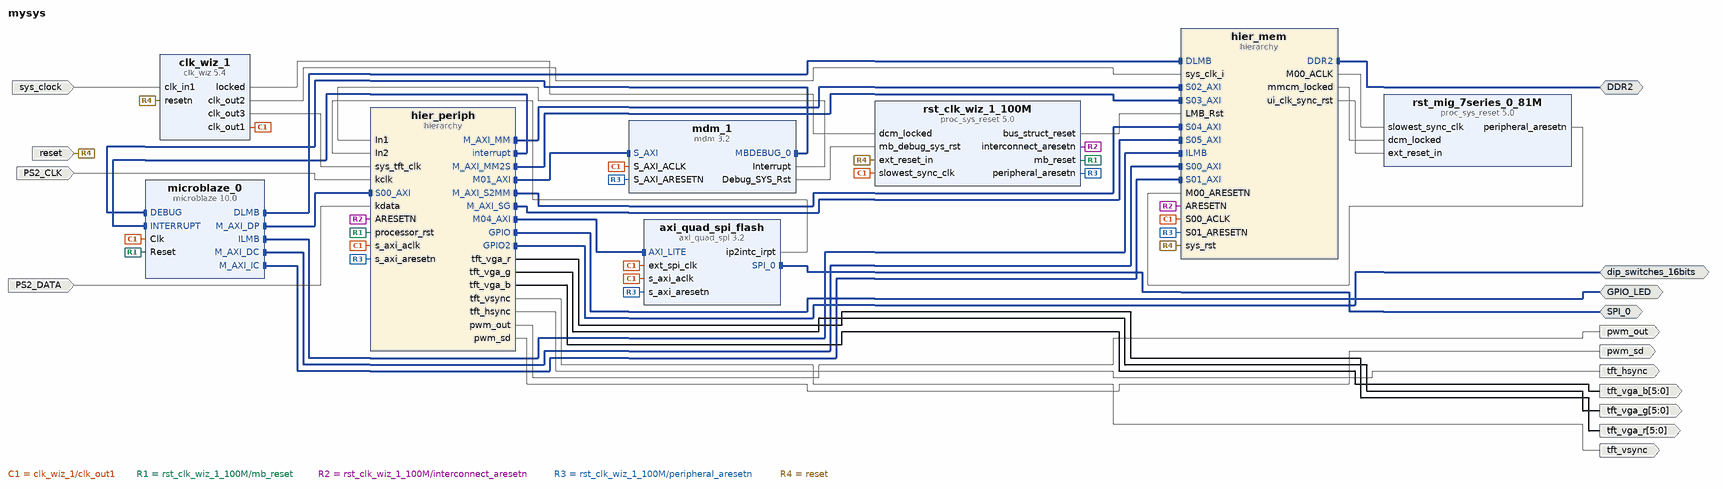
[diagram p0: block diagram of the top level]
# Vivado block design mysys, xc7a100tcsg324-1, Vivado 2017.1
create_bd_design mysys

create_bd_intf_port -mode Master -vlnv xilinx.com:interface:ddrx_rtl:1.0 DDR2
create_bd_intf_port -mode Master -vlnv xilinx.com:interface:gpio_rtl:1.0 GPIO_LED
create_bd_intf_port -mode Master -vlnv xilinx.com:interface:spi_rtl:1.0 SPI_0
create_bd_intf_port -mode Master -vlnv xilinx.com:interface:gpio_rtl:1.0 dip_switches_16bits
create_bd_port -dir I -type clk sys_clock
set_property -dict {CONFIG.FREQ_HZ 100000000 CONFIG.PHASE 0.000} [get_bd_ports sys_clock]
create_bd_port -dir I -type rst reset
set_property -dict {CONFIG.POLARITY ACTIVE_LOW} [get_bd_ports reset]
create_bd_port -dir O -from 5 -to 0 tft_vga_r
create_bd_port -dir O -from 5 -to 0 tft_vga_g
create_bd_port -dir O -from 5 -to 0 tft_vga_b
create_bd_port -dir O tft_vsync
create_bd_port -dir O tft_hsync
create_bd_port -dir O pwm_out
create_bd_port -dir O pwm_sd
create_bd_port -dir I PS2_CLK
create_bd_port -dir I PS2_DATA

create_bd_cell -type hier hier_mem
create_bd_cell -type ip -vlnv xilinx.com:ip:clk_wiz:5.4 clk_wiz_1
set_property -dict [list \
  CONFIG.CLKOUT2_USED true \
  CONFIG.CLKOUT3_USED true \
  CONFIG.CLKOUT4_USED false \
  CONFIG.NUM_OUT_CLKS 3 \
  CONFIG.CLKOUT2_REQUESTED_OUT_FREQ 200.000 \
  CONFIG.CLKOUT3_REQUESTED_OUT_FREQ 25.000 \
  CONFIG.RESET_PORT resetn \
  CONFIG.MMCM_CLKIN1_PERIOD 10.000 \
  CONFIG.MMCM_CLKIN2_PERIOD 10.000 \
  CONFIG.MMCM_CLKOUT1_DIVIDE 5 \
  CONFIG.MMCM_CLKOUT2_DIVIDE 40 \
  CONFIG.RESET_TYPE ACTIVE_LOW \
  CONFIG.USE_BOARD_FLOW true \
  CONFIG.CLK_IN1_BOARD_INTERFACE sys_clock \
  CONFIG.RESET_BOARD_INTERFACE reset \
  CONFIG.CLKOUT2_JITTER 114.829 \
  CONFIG.CLKOUT2_PHASE_ERROR 98.575 \
  CONFIG.CLKOUT3_JITTER 175.402 \
  CONFIG.CLKOUT3_PHASE_ERROR 98.575 \
  CONFIG.CLKOUT4_JITTER 130.958 \
  CONFIG.CLKOUT4_PHASE_ERROR 98.575 \
] [get_bd_cells clk_wiz_1]
create_bd_cell -type ip -vlnv xilinx.com:ip:microblaze:10.0 microblaze_0
set_property -dict [list \
  CONFIG.C_FREQ 100000000 \
  CONFIG.C_AREA_OPTIMIZED 2 \
  CONFIG.C_D_AXI 1 \
  CONFIG.C_D_LMB 1 \
  CONFIG.C_I_AXI 0 \
  CONFIG.C_I_LMB 1 \
  CONFIG.C_M_AXI_DC_USER_SIGNALS 0 \
  CONFIG.C_M_AXI_IC_USER_SIGNALS 0 \
  CONFIG.G_TEMPLATE_LIST 2 \
  CONFIG.G_USE_EXCEPTIONS 0 \
  CONFIG.C_USE_MSR_INSTR 1 \
  CONFIG.C_USE_PCMP_INSTR 1 \
  CONFIG.C_USE_BARREL 1 \
  CONFIG.C_USE_DIV 1 \
  CONFIG.C_USE_HW_MUL 2 \
  CONFIG.C_USE_FPU 2 \
  CONFIG.C_UNALIGNED_EXCEPTIONS 0 \
  CONFIG.C_ILL_OPCODE_EXCEPTION 0 \
  CONFIG.C_M_AXI_I_BUS_EXCEPTION 0 \
  CONFIG.C_M_AXI_D_BUS_EXCEPTION 0 \
  CONFIG.C_DIV_ZERO_EXCEPTION 0 \
  CONFIG.C_FPU_EXCEPTION 0 \
  CONFIG.C_PVR 0 \
  CONFIG.C_DEBUG_ENABLED 1 \
  CONFIG.C_NUMBER_OF_PC_BRK 1 \
  CONFIG.C_FSL_LINKS 0 \
  CONFIG.C_ICACHE_BASEADDR 0x0000000080000000 \
  CONFIG.C_ICACHE_HIGHADDR 0x0000000087FFFFFF \
  CONFIG.C_USE_ICACHE 1 \
  CONFIG.C_CACHE_BYTE_SIZE 32768 \
  CONFIG.C_ICACHE_LINE_LEN 16 \
  CONFIG.C_ICACHE_ALWAYS_USED 1 \
  CONFIG.C_ICACHE_VICTIMS 8 \
  CONFIG.C_ICACHE_STREAMS 1 \
  CONFIG.C_ICACHE_DATA_WIDTH 0 \
  CONFIG.C_DCACHE_BASEADDR 0x0000000080000000 \
  CONFIG.C_DCACHE_HIGHADDR 0x0000000087FFFFFF \
  CONFIG.C_USE_DCACHE 1 \
  CONFIG.C_DCACHE_BYTE_SIZE 32768 \
  CONFIG.C_DCACHE_LINE_LEN 16 \
  CONFIG.C_DCACHE_ALWAYS_USED 1 \
  CONFIG.C_DCACHE_USE_WRITEBACK 1 \
  CONFIG.C_DCACHE_VICTIMS 8 \
  CONFIG.C_DCACHE_DATA_WIDTH 0 \
  CONFIG.C_USE_MMU 0 \
  CONFIG.C_USE_INTERRUPT 1 \
  CONFIG.C_USE_EXT_BRK 0 \
  CONFIG.C_USE_EXT_NM_BRK 0 \
  CONFIG.C_USE_BRANCH_TARGET_CACHE 1 \
] [get_bd_cells microblaze_0]
create_bd_cell -type ip -vlnv xilinx.com:ip:proc_sys_reset:5.0 rst_clk_wiz_1_100M
set_property -dict [list \
  CONFIG.C_AUX_RESET_HIGH 0 \
  CONFIG.C_EXT_RESET_HIGH 0 \
  CONFIG.USE_BOARD_FLOW true \
  CONFIG.RESET_BOARD_INTERFACE reset \
] [get_bd_cells rst_clk_wiz_1_100M]
create_bd_cell -type ip -vlnv xilinx.com:ip:proc_sys_reset:5.0 rst_mig_7series_0_81M
set_property -dict {CONFIG.C_AUX_RESET_HIGH 0} [get_bd_cells rst_mig_7series_0_81M]
create_bd_cell -type ip -vlnv xilinx.com:ip:axi_quad_spi:3.2 axi_quad_spi_flash
set_property -dict {CONFIG.C_SCK_RATIO 2 CONFIG.C_S_AXI4_ID_WIDTH 0} [get_bd_cells axi_quad_spi_flash]
create_bd_cell -type ip -vlnv xilinx.com:ip:mdm:3.2 mdm_1
set_property -dict {CONFIG.C_USE_UART 1} [get_bd_cells mdm_1]
create_bd_cell -type hier hier_periph

# ---- hierarchy /hier_mem ----
current_bd_instance /hier_mem
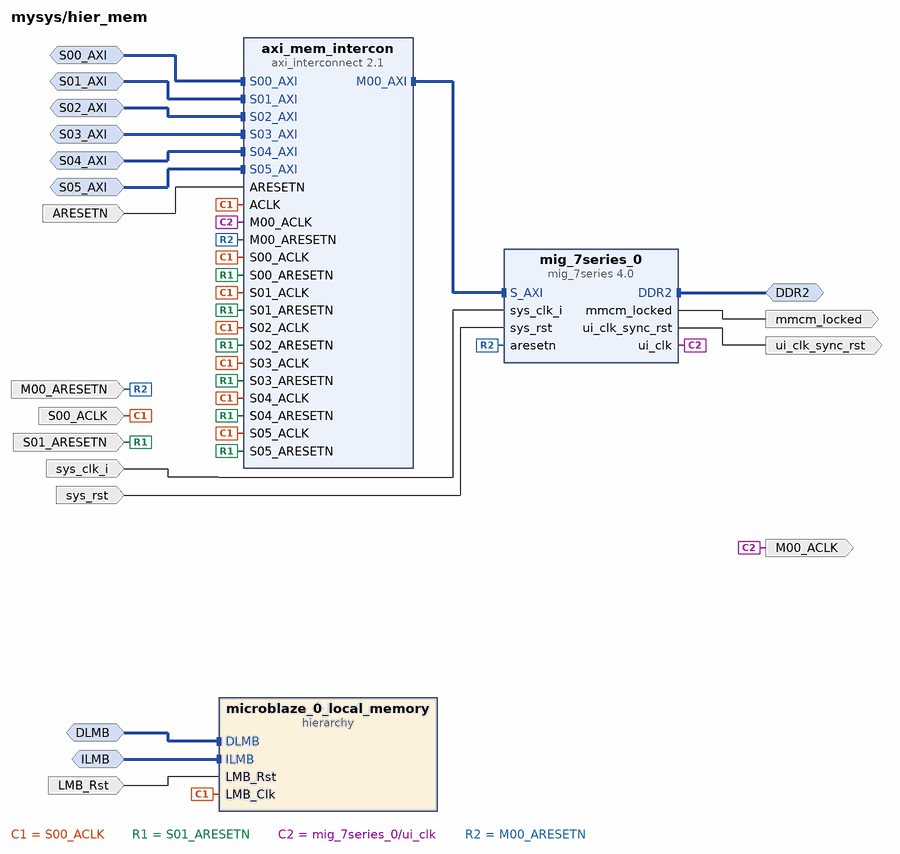
[diagram p1: block diagram inside /hier_mem]
create_bd_intf_pin -mode Master -vlnv xilinx.com:interface:ddrx_rtl:1.0 DDR2
create_bd_intf_pin -mode MirroredMaster -vlnv xilinx.com:interface:lmb_rtl:1.0 DLMB
create_bd_intf_pin -mode MirroredMaster -vlnv xilinx.com:interface:lmb_rtl:1.0 ILMB
create_bd_intf_pin -mode Slave -vlnv xilinx.com:interface:aximm_rtl:1.0 S00_AXI
create_bd_intf_pin -mode Slave -vlnv xilinx.com:interface:aximm_rtl:1.0 S01_AXI
create_bd_intf_pin -mode Slave -vlnv xilinx.com:interface:aximm_rtl:1.0 S02_AXI
create_bd_intf_pin -mode Slave -vlnv xilinx.com:interface:aximm_rtl:1.0 S03_AXI
create_bd_intf_pin -mode Slave -vlnv xilinx.com:interface:aximm_rtl:1.0 S04_AXI
create_bd_intf_pin -mode Slave -vlnv xilinx.com:interface:aximm_rtl:1.0 S05_AXI
create_bd_pin -dir I -type clk S00_ACLK
create_bd_pin -dir I -type rst LMB_Rst
create_bd_pin -dir I -type rst S01_ARESETN
create_bd_pin -dir I -type rst ARESETN
create_bd_pin -dir I -type clk sys_clk_i
create_bd_pin -dir I -type rst sys_rst
create_bd_pin -dir O -type clk M00_ACLK
create_bd_pin -dir O -type rst ui_clk_sync_rst
create_bd_pin -dir I -type rst M00_ARESETN
create_bd_pin -dir O mmcm_locked

create_bd_cell -type hier microblaze_0_local_memory
create_bd_cell -type ip -vlnv xilinx.com:ip:axi_interconnect:2.1 axi_mem_intercon
set_property -dict {CONFIG.NUM_SI 6 CONFIG.NUM_MI 1} [get_bd_cells axi_mem_intercon]
create_bd_cell -type ip -vlnv xilinx.com:ip:mig_7series:4.0 mig_7series_0
set_property -dict [list \
  CONFIG.XML_INPUT_FILE mig_b.prj \
  CONFIG.RESET_BOARD_INTERFACE reset \
  CONFIG.MIG_DONT_TOUCH_PARAM Custom \
  CONFIG.BOARD_MIG_PARAM Custom \
] [get_bd_cells mig_7series_0]

# ---- hierarchy /hier_mem/microblaze_0_local_memory ----
current_bd_instance /hier_mem/microblaze_0_local_memory
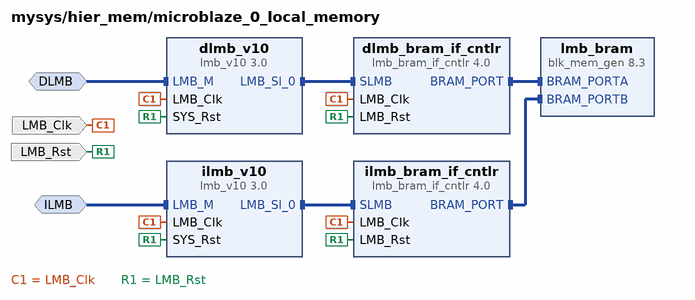
[diagram p2: block diagram inside /hier_mem/microblaze_0_local_memory]
create_bd_intf_pin -mode MirroredMaster -vlnv xilinx.com:interface:lmb_rtl:1.0 DLMB
create_bd_intf_pin -mode MirroredMaster -vlnv xilinx.com:interface:lmb_rtl:1.0 ILMB
create_bd_pin -dir I -type clk LMB_Clk
create_bd_pin -dir I -type rst LMB_Rst

create_bd_cell -type ip -vlnv xilinx.com:ip:lmb_bram_if_cntlr:4.0 dlmb_bram_if_cntlr
set_property -dict [list \
  CONFIG.C_BASEADDR 0x0000000000000000 \
  CONFIG.C_HIGHADDR 0x0000000000003FFF \
  CONFIG.C_MASK 0x00000000C0000000 \
  CONFIG.C_ECC 0 \
] [get_bd_cells dlmb_bram_if_cntlr]
create_bd_cell -type ip -vlnv xilinx.com:ip:lmb_v10:3.0 dlmb_v10
create_bd_cell -type ip -vlnv xilinx.com:ip:lmb_bram_if_cntlr:4.0 ilmb_bram_if_cntlr
set_property -dict [list \
  CONFIG.C_BASEADDR 0x0000000000000000 \
  CONFIG.C_HIGHADDR 0x0000000000003FFF \
  CONFIG.C_MASK 0x0000000080000000 \
  CONFIG.C_ECC 0 \
] [get_bd_cells ilmb_bram_if_cntlr]
create_bd_cell -type ip -vlnv xilinx.com:ip:lmb_v10:3.0 ilmb_v10
create_bd_cell -type ip -vlnv xilinx.com:ip:blk_mem_gen:8.3 lmb_bram
set_property -dict [list \
  CONFIG.Memory_Type True_Dual_Port_RAM \
  CONFIG.Enable_B Use_ENB_Pin \
  CONFIG.Use_RSTB_Pin true \
  CONFIG.Port_B_Clock 100 \
  CONFIG.Port_B_Write_Rate 50 \
  CONFIG.Port_B_Enable_Rate 100 \
  CONFIG.use_bram_block BRAM_Controller \
] [get_bd_cells lmb_bram]

# ---- hierarchy /hier_periph ----
current_bd_instance /hier_periph
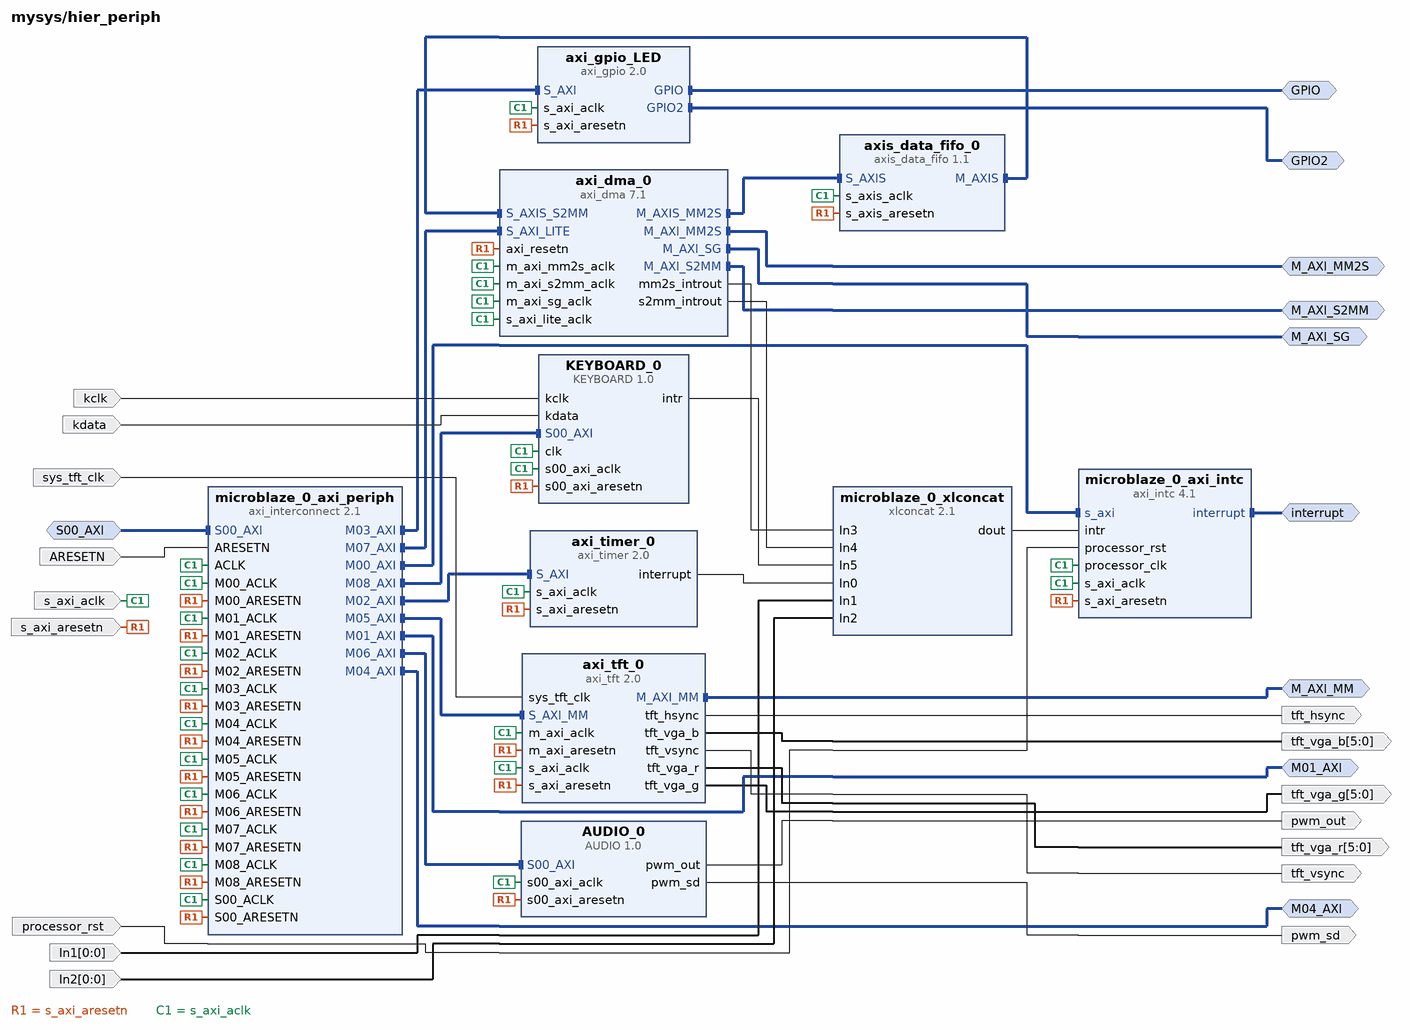
[diagram p3: block diagram inside /hier_periph]
create_bd_intf_pin -mode Master -vlnv xilinx.com:interface:gpio_rtl:1.0 GPIO
create_bd_intf_pin -mode Master -vlnv xilinx.com:interface:aximm_rtl:1.0 M_AXI_MM
create_bd_intf_pin -mode Master -vlnv xilinx.com:interface:mbinterrupt_rtl:1.0 interrupt
create_bd_intf_pin -mode Master -vlnv xilinx.com:interface:aximm_rtl:1.0 M_AXI_SG
create_bd_intf_pin -mode Master -vlnv xilinx.com:interface:aximm_rtl:1.0 M_AXI_MM2S
create_bd_intf_pin -mode Master -vlnv xilinx.com:interface:aximm_rtl:1.0 M_AXI_S2MM
create_bd_intf_pin -mode Slave -vlnv xilinx.com:interface:aximm_rtl:1.0 S00_AXI
create_bd_intf_pin -mode Master -vlnv xilinx.com:interface:aximm_rtl:1.0 M01_AXI
create_bd_intf_pin -mode Master -vlnv xilinx.com:interface:aximm_rtl:1.0 M04_AXI
create_bd_intf_pin -mode Master -vlnv xilinx.com:interface:gpio_rtl:1.0 GPIO2
create_bd_pin -dir I -type rst s_axi_aresetn
create_bd_pin -dir I -type clk s_axi_aclk
create_bd_pin -dir I -type clk sys_tft_clk
create_bd_pin -dir O tft_hsync
create_bd_pin -dir O tft_vsync
create_bd_pin -dir O -from 5 -to 0 tft_vga_r
create_bd_pin -dir O -from 5 -to 0 tft_vga_g
create_bd_pin -dir O -from 5 -to 0 tft_vga_b
create_bd_pin -dir I kclk
create_bd_pin -dir I kdata
create_bd_pin -dir O pwm_out
create_bd_pin -dir O pwm_sd
create_bd_pin -dir I -type rst processor_rst
create_bd_pin -dir I -from 0 -to 0 In1
create_bd_pin -dir I -from 0 -to 0 In2
create_bd_pin -dir I -type rst ARESETN

create_bd_cell -type ip -vlnv xilinx.com:ip:axis_data_fifo:1.1 axis_data_fifo_0
set_property -dict {CONFIG.FIFO_DEPTH 128} [get_bd_cells axis_data_fifo_0]
create_bd_cell -type ip -vlnv xilinx.com:ip:axi_gpio:2.0 axi_gpio_LED
set_property -dict [list \
  CONFIG.USE_BOARD_FLOW true \
  CONFIG.GPIO_BOARD_INTERFACE led_16bits \
  CONFIG.GPIO2_BOARD_INTERFACE dip_switches_16bits \
] [get_bd_cells axi_gpio_LED]
create_bd_cell -type ip -vlnv xilinx.com:ip:axi_tft:2.0 axi_tft_0
set_property -dict [list \
  CONFIG.C_MAX_BURST_LEN 256 \
  CONFIG.C_M_AXI_DATA_WIDTH 32 \
  CONFIG.C_DEFAULT_TFT_BASE_ADDR 0x00000000F0000000 \
  CONFIG.C_EN_I2C_INTF 0 \
  CONFIG.C_TFT_INTERFACE 0 \
] [get_bd_cells axi_tft_0]
create_bd_cell -type ip -vlnv xilinx.com:user:AUDIO:1.0 AUDIO_0
create_bd_cell -type ip -vlnv xilinx.com:ip:axi_intc:4.1 microblaze_0_axi_intc
set_property -dict {CONFIG.C_HAS_FAST 1} [get_bd_cells microblaze_0_axi_intc]
create_bd_cell -type ip -vlnv xilinx.com:ip:xlconcat:2.1 microblaze_0_xlconcat
set_property -dict {CONFIG.NUM_PORTS 6 CONFIG.dout_width 6} [get_bd_cells microblaze_0_xlconcat]
create_bd_cell -type ip -vlnv xilinx.com:ip:axi_timer:2.0 axi_timer_0
create_bd_cell -type ip -vlnv xilinx.com:ip:axi_dma:7.1 axi_dma_0
set_property -dict [list \
  CONFIG.c_include_sg 1 \
  CONFIG.c_enable_multi_channel 0 \
  CONFIG.c_sg_include_stscntrl_strm 0 \
  CONFIG.c_micro_dma 0 \
  CONFIG.c_include_mm2s_dre 0 \
  CONFIG.c_mm2s_burst_size 16 \
  CONFIG.c_include_s2mm_dre 0 \
  CONFIG.c_s2mm_burst_size 64 \
] [get_bd_cells axi_dma_0]
create_bd_cell -type ip -vlnv xilinx.com:ip:axi_interconnect:2.1 microblaze_0_axi_periph
set_property -dict {CONFIG.NUM_MI 9} [get_bd_cells microblaze_0_axi_periph]
create_bd_cell -type ip -vlnv xilinx.com:user:KEYBOARD:1.0 KEYBOARD_0

# ---- connections ----

current_bd_instance /hier_mem
connect_bd_intf_net [get_bd_intf_pins axi_mem_intercon/M00_AXI] [get_bd_intf_pins mig_7series_0/S_AXI]
connect_bd_intf_net [get_bd_intf_pins DDR2] [get_bd_intf_pins mig_7series_0/DDR2]
connect_bd_intf_net -intf_net microblaze_0_dlmb_1 [get_bd_intf_pins DLMB] [get_bd_intf_pins microblaze_0_local_memory/DLMB]
connect_bd_intf_net -intf_net microblaze_0_ilmb_1 [get_bd_intf_pins ILMB] [get_bd_intf_pins microblaze_0_local_memory/ILMB]
connect_bd_intf_net -intf_net microblaze_0_M_AXI_DC [get_bd_intf_pins S00_AXI] [get_bd_intf_pins axi_mem_intercon/S00_AXI]
connect_bd_intf_net -intf_net microblaze_0_M_AXI_IC [get_bd_intf_pins S01_AXI] [get_bd_intf_pins axi_mem_intercon/S01_AXI]
connect_bd_intf_net [get_bd_intf_pins S02_AXI] [get_bd_intf_pins axi_mem_intercon/S02_AXI]
connect_bd_intf_net [get_bd_intf_pins S03_AXI] [get_bd_intf_pins axi_mem_intercon/S03_AXI]
connect_bd_intf_net [get_bd_intf_pins S04_AXI] [get_bd_intf_pins axi_mem_intercon/S04_AXI]
connect_bd_intf_net [get_bd_intf_pins S05_AXI] [get_bd_intf_pins axi_mem_intercon/S05_AXI]
connect_bd_net -net microblaze_0_Clk [get_bd_pins S00_ACLK] \
  [get_bd_pins microblaze_0_local_memory/LMB_Clk] [get_bd_pins axi_mem_intercon/ACLK] [get_bd_pins axi_mem_intercon/S00_ACLK] \
  [get_bd_pins axi_mem_intercon/S01_ACLK] [get_bd_pins axi_mem_intercon/S02_ACLK] [get_bd_pins axi_mem_intercon/S03_ACLK] \
  [get_bd_pins axi_mem_intercon/S04_ACLK] [get_bd_pins axi_mem_intercon/S05_ACLK]
connect_bd_net -net rst_clk_wiz_1_100M_bus_struct_reset [get_bd_pins LMB_Rst] [get_bd_pins microblaze_0_local_memory/LMB_Rst]
connect_bd_net -net rst_clk_wiz_1_100M_peripheral_aresetn [get_bd_pins S01_ARESETN] \
  [get_bd_pins axi_mem_intercon/S00_ARESETN] [get_bd_pins axi_mem_intercon/S01_ARESETN] \
  [get_bd_pins axi_mem_intercon/S02_ARESETN] [get_bd_pins axi_mem_intercon/S03_ARESETN] \
  [get_bd_pins axi_mem_intercon/S04_ARESETN] [get_bd_pins axi_mem_intercon/S05_ARESETN]
connect_bd_net -net rst_clk_wiz_1_100M_interconnect_aresetn [get_bd_pins ARESETN] [get_bd_pins axi_mem_intercon/ARESETN]
connect_bd_net -net clk_wiz_1_clk_out2 [get_bd_pins sys_clk_i] [get_bd_pins mig_7series_0/sys_clk_i]
connect_bd_net -net reset_1 [get_bd_pins sys_rst] [get_bd_pins mig_7series_0/sys_rst]
connect_bd_net [get_bd_pins mig_7series_0/ui_clk] [get_bd_pins M00_ACLK] [get_bd_pins axi_mem_intercon/M00_ACLK]
connect_bd_net [get_bd_pins mig_7series_0/ui_clk_sync_rst] [get_bd_pins ui_clk_sync_rst]
connect_bd_net -net rst_mig_7series_0_81M_peripheral_aresetn [get_bd_pins M00_ARESETN] \
  [get_bd_pins mig_7series_0/aresetn] [get_bd_pins axi_mem_intercon/M00_ARESETN]
connect_bd_net [get_bd_pins mig_7series_0/mmcm_locked] [get_bd_pins mmcm_locked]

current_bd_instance /hier_mem/microblaze_0_local_memory
connect_bd_intf_net -intf_net microblaze_0_dlmb_bus [get_bd_intf_pins dlmb_v10/LMB_Sl_0] [get_bd_intf_pins dlmb_bram_if_cntlr/SLMB]
connect_bd_intf_net -intf_net microblaze_0_ilmb_bus [get_bd_intf_pins ilmb_v10/LMB_Sl_0] [get_bd_intf_pins ilmb_bram_if_cntlr/SLMB]
connect_bd_intf_net -intf_net microblaze_0_dlmb_cntlr [get_bd_intf_pins dlmb_bram_if_cntlr/BRAM_PORT] [get_bd_intf_pins lmb_bram/BRAM_PORTA]
connect_bd_intf_net -intf_net microblaze_0_ilmb_cntlr [get_bd_intf_pins ilmb_bram_if_cntlr/BRAM_PORT] [get_bd_intf_pins lmb_bram/BRAM_PORTB]
connect_bd_intf_net -intf_net microblaze_0_dlmb [get_bd_intf_pins DLMB] [get_bd_intf_pins dlmb_v10/LMB_M]
connect_bd_intf_net -intf_net microblaze_0_ilmb [get_bd_intf_pins ILMB] [get_bd_intf_pins ilmb_v10/LMB_M]
connect_bd_net -net microblaze_0_Clk [get_bd_pins LMB_Clk] \
  [get_bd_pins dlmb_bram_if_cntlr/LMB_Clk] [get_bd_pins dlmb_v10/LMB_Clk] [get_bd_pins ilmb_bram_if_cntlr/LMB_Clk] \
  [get_bd_pins ilmb_v10/LMB_Clk]
connect_bd_net -net microblaze_0_LMB_Rst [get_bd_pins LMB_Rst] \
  [get_bd_pins dlmb_bram_if_cntlr/LMB_Rst] [get_bd_pins dlmb_v10/SYS_Rst] [get_bd_pins ilmb_bram_if_cntlr/LMB_Rst] \
  [get_bd_pins ilmb_v10/SYS_Rst]

current_bd_instance /hier_periph
connect_bd_intf_net [get_bd_intf_pins axi_dma_0/M_AXIS_MM2S] [get_bd_intf_pins axis_data_fifo_0/S_AXIS]
connect_bd_intf_net [get_bd_intf_pins axi_dma_0/S_AXIS_S2MM] [get_bd_intf_pins axis_data_fifo_0/M_AXIS]
connect_bd_intf_net [get_bd_intf_pins microblaze_0_axi_periph/M03_AXI] [get_bd_intf_pins axi_gpio_LED/S_AXI]
connect_bd_intf_net [get_bd_intf_pins axi_tft_0/S_AXI_MM] [get_bd_intf_pins microblaze_0_axi_periph/M05_AXI]
connect_bd_intf_net [get_bd_intf_pins microblaze_0_axi_periph/M08_AXI] [get_bd_intf_pins KEYBOARD_0/S00_AXI]
connect_bd_intf_net [get_bd_intf_pins AUDIO_0/S00_AXI] [get_bd_intf_pins microblaze_0_axi_periph/M06_AXI]
connect_bd_intf_net [get_bd_intf_pins microblaze_0_axi_periph/M00_AXI] [get_bd_intf_pins microblaze_0_axi_intc/s_axi]
connect_bd_intf_net [get_bd_intf_pins microblaze_0_axi_periph/M02_AXI] [get_bd_intf_pins axi_timer_0/S_AXI]
connect_bd_intf_net [get_bd_intf_pins axi_dma_0/S_AXI_LITE] [get_bd_intf_pins microblaze_0_axi_periph/M07_AXI]
connect_bd_intf_net [get_bd_intf_pins GPIO] [get_bd_intf_pins axi_gpio_LED/GPIO]
connect_bd_intf_net [get_bd_intf_pins M_AXI_MM] [get_bd_intf_pins axi_tft_0/M_AXI_MM]
connect_bd_intf_net -intf_net axi_intc_0_interrupt [get_bd_intf_pins interrupt] [get_bd_intf_pins microblaze_0_axi_intc/interrupt]
connect_bd_intf_net [get_bd_intf_pins M_AXI_SG] [get_bd_intf_pins axi_dma_0/M_AXI_SG]
connect_bd_intf_net [get_bd_intf_pins M_AXI_MM2S] [get_bd_intf_pins axi_dma_0/M_AXI_MM2S]
connect_bd_intf_net [get_bd_intf_pins M_AXI_S2MM] [get_bd_intf_pins axi_dma_0/M_AXI_S2MM]
connect_bd_intf_net -intf_net microblaze_0_axi_dp [get_bd_intf_pins S00_AXI] [get_bd_intf_pins microblaze_0_axi_periph/S00_AXI]
connect_bd_intf_net -intf_net microblaze_0_mdm_axi [get_bd_intf_pins M01_AXI] [get_bd_intf_pins microblaze_0_axi_periph/M01_AXI]
connect_bd_intf_net [get_bd_intf_pins M04_AXI] [get_bd_intf_pins microblaze_0_axi_periph/M04_AXI]
connect_bd_intf_net [get_bd_intf_pins GPIO2] [get_bd_intf_pins axi_gpio_LED/GPIO2]
connect_bd_net [get_bd_pins KEYBOARD_0/intr] [get_bd_pins microblaze_0_xlconcat/In5]
connect_bd_net [get_bd_pins microblaze_0_xlconcat/dout] [get_bd_pins microblaze_0_axi_intc/intr]
connect_bd_net [get_bd_pins axi_timer_0/interrupt] [get_bd_pins microblaze_0_xlconcat/In0]
connect_bd_net [get_bd_pins axi_dma_0/mm2s_introut] [get_bd_pins microblaze_0_xlconcat/In3]
connect_bd_net [get_bd_pins axi_dma_0/s2mm_introut] [get_bd_pins microblaze_0_xlconcat/In4]
connect_bd_net -net rst_clk_wiz_1_100M_peripheral_aresetn [get_bd_pins s_axi_aresetn] \
  [get_bd_pins axi_tft_0/s_axi_aresetn] [get_bd_pins axi_tft_0/m_axi_aresetn] [get_bd_pins AUDIO_0/s00_axi_aresetn] \
  [get_bd_pins axi_dma_0/axi_resetn] [get_bd_pins axi_gpio_LED/s_axi_aresetn] [get_bd_pins axi_timer_0/s_axi_aresetn] \
  [get_bd_pins microblaze_0_axi_intc/s_axi_aresetn] [get_bd_pins axis_data_fifo_0/s_axis_aresetn] \
  [get_bd_pins KEYBOARD_0/s00_axi_aresetn] [get_bd_pins microblaze_0_axi_periph/S00_ARESETN] \
  [get_bd_pins microblaze_0_axi_periph/M00_ARESETN] [get_bd_pins microblaze_0_axi_periph/M01_ARESETN] \
  [get_bd_pins microblaze_0_axi_periph/M02_ARESETN] [get_bd_pins microblaze_0_axi_periph/M03_ARESETN] \
  [get_bd_pins microblaze_0_axi_periph/M04_ARESETN] [get_bd_pins microblaze_0_axi_periph/M05_ARESETN] \
  [get_bd_pins microblaze_0_axi_periph/M06_ARESETN] [get_bd_pins microblaze_0_axi_periph/M07_ARESETN] \
  [get_bd_pins microblaze_0_axi_periph/M08_ARESETN]
connect_bd_net -net microblaze_0_Clk [get_bd_pins s_axi_aclk] \
  [get_bd_pins axi_tft_0/s_axi_aclk] [get_bd_pins axi_tft_0/m_axi_aclk] [get_bd_pins AUDIO_0/s00_axi_aclk] \
  [get_bd_pins axi_dma_0/s_axi_lite_aclk] [get_bd_pins axi_dma_0/m_axi_mm2s_aclk] [get_bd_pins axi_dma_0/m_axi_s2mm_aclk] \
  [get_bd_pins axi_dma_0/m_axi_sg_aclk] [get_bd_pins axi_gpio_LED/s_axi_aclk] [get_bd_pins axi_timer_0/s_axi_aclk] \
  [get_bd_pins microblaze_0_axi_intc/s_axi_aclk] [get_bd_pins microblaze_0_axi_intc/processor_clk] \
  [get_bd_pins axis_data_fifo_0/s_axis_aclk] [get_bd_pins KEYBOARD_0/clk] [get_bd_pins KEYBOARD_0/s00_axi_aclk] \
  [get_bd_pins microblaze_0_axi_periph/ACLK] [get_bd_pins microblaze_0_axi_periph/S00_ACLK] \
  [get_bd_pins microblaze_0_axi_periph/M00_ACLK] [get_bd_pins microblaze_0_axi_periph/M01_ACLK] \
  [get_bd_pins microblaze_0_axi_periph/M02_ACLK] [get_bd_pins microblaze_0_axi_periph/M03_ACLK] \
  [get_bd_pins microblaze_0_axi_periph/M04_ACLK] [get_bd_pins microblaze_0_axi_periph/M05_ACLK] \
  [get_bd_pins microblaze_0_axi_periph/M06_ACLK] [get_bd_pins microblaze_0_axi_periph/M07_ACLK] \
  [get_bd_pins microblaze_0_axi_periph/M08_ACLK]
connect_bd_net -net clk_wiz_1_clk_out3 [get_bd_pins sys_tft_clk] [get_bd_pins axi_tft_0/sys_tft_clk]
connect_bd_net [get_bd_pins axi_tft_0/tft_hsync] [get_bd_pins tft_hsync]
connect_bd_net [get_bd_pins axi_tft_0/tft_vsync] [get_bd_pins tft_vsync]
connect_bd_net [get_bd_pins axi_tft_0/tft_vga_r] [get_bd_pins tft_vga_r]
connect_bd_net [get_bd_pins axi_tft_0/tft_vga_g] [get_bd_pins tft_vga_g]
connect_bd_net [get_bd_pins axi_tft_0/tft_vga_b] [get_bd_pins tft_vga_b]
connect_bd_net [get_bd_pins kclk] [get_bd_pins KEYBOARD_0/kclk]
connect_bd_net [get_bd_pins kdata] [get_bd_pins KEYBOARD_0/kdata]
connect_bd_net [get_bd_pins AUDIO_0/pwm_out] [get_bd_pins pwm_out]
connect_bd_net [get_bd_pins AUDIO_0/pwm_sd] [get_bd_pins pwm_sd]
connect_bd_net -net rst_clk_wiz_1_100M_mb_reset [get_bd_pins processor_rst] [get_bd_pins microblaze_0_axi_intc/processor_rst]
connect_bd_net -net mdm_1_Interrupt [get_bd_pins In1] [get_bd_pins microblaze_0_xlconcat/In1]
connect_bd_net -net axi_quad_spi_flash_ip2intc_irpt [get_bd_pins In2] [get_bd_pins microblaze_0_xlconcat/In2]
connect_bd_net -net rst_clk_wiz_1_100M_interconnect_aresetn [get_bd_pins ARESETN] [get_bd_pins microblaze_0_axi_periph/ARESETN]

current_bd_instance /
connect_bd_intf_net [get_bd_intf_pins microblaze_0/DLMB] [get_bd_intf_pins hier_mem/DLMB]
connect_bd_intf_net [get_bd_intf_pins microblaze_0/ILMB] [get_bd_intf_pins hier_mem/ILMB]
connect_bd_intf_net -intf_net microblaze_0_axi_dp [get_bd_intf_pins hier_periph/S00_AXI] [get_bd_intf_pins microblaze_0/M_AXI_DP]
connect_bd_intf_net [get_bd_intf_pins mdm_1/MBDEBUG_0] [get_bd_intf_pins microblaze_0/DEBUG]
connect_bd_intf_net [get_bd_intf_pins microblaze_0/M_AXI_DC] [get_bd_intf_pins hier_mem/S00_AXI]
connect_bd_intf_net [get_bd_intf_pins microblaze_0/M_AXI_IC] [get_bd_intf_pins hier_mem/S01_AXI]
connect_bd_intf_net -intf_net axi_tft_0_M_AXI_MM [get_bd_intf_pins hier_periph/M_AXI_MM] [get_bd_intf_pins hier_mem/S02_AXI]
connect_bd_intf_net -intf_net axi_dma_0_M_AXI_MM2S [get_bd_intf_pins hier_periph/M_AXI_MM2S] [get_bd_intf_pins hier_mem/S03_AXI]
connect_bd_intf_net -intf_net axi_dma_0_M_AXI_S2MM [get_bd_intf_pins hier_periph/M_AXI_S2MM] [get_bd_intf_pins hier_mem/S04_AXI]
connect_bd_intf_net -intf_net axi_dma_0_M_AXI_SG [get_bd_intf_pins hier_periph/M_AXI_SG] [get_bd_intf_pins hier_mem/S05_AXI]
connect_bd_intf_net [get_bd_intf_pins hier_periph/M04_AXI] [get_bd_intf_pins axi_quad_spi_flash/AXI_LITE]
connect_bd_intf_net -intf_net microblaze_0_mdm_axi [get_bd_intf_pins hier_periph/M01_AXI] [get_bd_intf_pins mdm_1/S_AXI]
connect_bd_intf_net -intf_net axi_intc_0_interrupt [get_bd_intf_pins microblaze_0/INTERRUPT] [get_bd_intf_pins hier_periph/interrupt]
connect_bd_intf_net -intf_net mig_7series_0_DDR2 [get_bd_intf_ports DDR2] [get_bd_intf_pins hier_mem/DDR2]
connect_bd_intf_net -intf_net axi_gpio_LED_GPIO [get_bd_intf_ports GPIO_LED] [get_bd_intf_pins hier_periph/GPIO]
connect_bd_intf_net -intf_net axi_quad_spi_0_SPI_0 [get_bd_intf_ports SPI_0] [get_bd_intf_pins axi_quad_spi_flash/SPI_0]
connect_bd_intf_net [get_bd_intf_ports dip_switches_16bits] [get_bd_intf_pins hier_periph/GPIO2]
connect_bd_net -net microblaze_0_Clk [get_bd_pins clk_wiz_1/clk_out1] \
  [get_bd_pins microblaze_0/Clk] [get_bd_pins rst_clk_wiz_1_100M/slowest_sync_clk] \
  [get_bd_pins axi_quad_spi_flash/ext_spi_clk] [get_bd_pins axi_quad_spi_flash/s_axi_aclk] [get_bd_pins mdm_1/S_AXI_ACLK] \
  [get_bd_pins hier_mem/S00_ACLK] [get_bd_pins hier_periph/s_axi_aclk]
connect_bd_net [get_bd_pins clk_wiz_1/locked] [get_bd_pins rst_clk_wiz_1_100M/dcm_locked]
connect_bd_net [get_bd_pins rst_clk_wiz_1_100M/mb_reset] [get_bd_pins microblaze_0/Reset] [get_bd_pins hier_periph/processor_rst]
connect_bd_net [get_bd_pins rst_clk_wiz_1_100M/bus_struct_reset] [get_bd_pins hier_mem/LMB_Rst]
connect_bd_net [get_bd_pins rst_clk_wiz_1_100M/interconnect_aresetn] [get_bd_pins hier_mem/ARESETN] [get_bd_pins hier_periph/ARESETN]
connect_bd_net [get_bd_pins rst_clk_wiz_1_100M/peripheral_aresetn] \
  [get_bd_pins axi_quad_spi_flash/s_axi_aresetn] [get_bd_pins mdm_1/S_AXI_ARESETN] [get_bd_pins hier_mem/S01_ARESETN] \
  [get_bd_pins hier_periph/s_axi_aresetn]
connect_bd_net [get_bd_pins mdm_1/Debug_SYS_Rst] [get_bd_pins rst_clk_wiz_1_100M/mb_debug_sys_rst]
connect_bd_net [get_bd_pins clk_wiz_1/clk_out2] [get_bd_pins hier_mem/sys_clk_i]
connect_bd_net [get_bd_ports sys_clock] [get_bd_pins clk_wiz_1/clk_in1]
connect_bd_net [get_bd_ports reset] [get_bd_pins clk_wiz_1/resetn] [get_bd_pins rst_clk_wiz_1_100M/ext_reset_in] [get_bd_pins hier_mem/sys_rst]
connect_bd_net -net mig_7series_0_ui_clk [get_bd_pins hier_mem/M00_ACLK] [get_bd_pins rst_mig_7series_0_81M/slowest_sync_clk]
connect_bd_net -net mig_7series_0_mmcm_locked [get_bd_pins hier_mem/mmcm_locked] [get_bd_pins rst_mig_7series_0_81M/dcm_locked]
connect_bd_net -net mig_7series_0_ui_clk_sync_rst [get_bd_pins hier_mem/ui_clk_sync_rst] [get_bd_pins rst_mig_7series_0_81M/ext_reset_in]
connect_bd_net [get_bd_pins rst_mig_7series_0_81M/peripheral_aresetn] [get_bd_pins hier_mem/M00_ARESETN]
connect_bd_net [get_bd_pins clk_wiz_1/clk_out3] [get_bd_pins hier_periph/sys_tft_clk]
connect_bd_net -net axi_tft_0_tft_vga_r [get_bd_pins hier_periph/tft_vga_r] [get_bd_ports tft_vga_r]
connect_bd_net -net axi_tft_0_tft_vga_g [get_bd_pins hier_periph/tft_vga_g] [get_bd_ports tft_vga_g]
connect_bd_net -net axi_tft_0_tft_vga_b [get_bd_pins hier_periph/tft_vga_b] [get_bd_ports tft_vga_b]
connect_bd_net -net axi_tft_0_tft_vsync [get_bd_pins hier_periph/tft_vsync] [get_bd_ports tft_vsync]
connect_bd_net -net axi_tft_0_tft_hsync [get_bd_pins hier_periph/tft_hsync] [get_bd_ports tft_hsync]
connect_bd_net -net AUDIO_0_pwm_out [get_bd_pins hier_periph/pwm_out] [get_bd_ports pwm_out]
connect_bd_net -net AUDIO_0_pwm_sd [get_bd_pins hier_periph/pwm_sd] [get_bd_ports pwm_sd]
connect_bd_net [get_bd_pins axi_quad_spi_flash/ip2intc_irpt] [get_bd_pins hier_periph/In2]
connect_bd_net [get_bd_pins mdm_1/Interrupt] [get_bd_pins hier_periph/In1]
connect_bd_net -net kclk_1 [get_bd_ports PS2_CLK] [get_bd_pins hier_periph/kclk]
connect_bd_net -net kdata_1 [get_bd_ports PS2_DATA] [get_bd_pins hier_periph/kdata]

# ---- address map ----
assign_bd_address -offset 0x80000000 -range 128M -target_address_space [get_bd_addr_spaces hier_periph/axi_dma_0/Data_MM2S] [get_bd_addr_segs hier_mem/mig_7series_0/memmap/memaddr]
assign_bd_address -offset 0x80000000 -range 128M -target_address_space [get_bd_addr_spaces hier_periph/axi_dma_0/Data_S2MM] [get_bd_addr_segs hier_mem/mig_7series_0/memmap/memaddr]
assign_bd_address -offset 0x80000000 -range 128M -target_address_space [get_bd_addr_spaces hier_periph/axi_dma_0/Data_SG] [get_bd_addr_segs hier_mem/mig_7series_0/memmap/memaddr]
assign_bd_address -offset 0x80000000 -range 128M -target_address_space [get_bd_addr_spaces hier_periph/axi_tft_0/Video_data] [get_bd_addr_segs hier_mem/mig_7series_0/memmap/memaddr]
assign_bd_address -offset 0x00000000 -range 16K -target_address_space [get_bd_addr_spaces microblaze_0/Data] [get_bd_addr_segs hier_mem/microblaze_0_local_memory/dlmb_bram_if_cntlr/SLMB/Mem]
assign_bd_address -offset 0x40000000 -range 64K -target_address_space [get_bd_addr_spaces microblaze_0/Data] [get_bd_addr_segs hier_periph/axi_gpio_LED/S_AXI/Reg]
assign_bd_address -offset 0x41200000 -range 64K -target_address_space [get_bd_addr_spaces microblaze_0/Data] [get_bd_addr_segs hier_periph/microblaze_0_axi_intc/S_AXI/Reg]
assign_bd_address -offset 0x41400000 -range 4K -target_address_space [get_bd_addr_spaces microblaze_0/Data] [get_bd_addr_segs mdm_1/S_AXI/Reg]
assign_bd_address -offset 0x41C00000 -range 64K -target_address_space [get_bd_addr_spaces microblaze_0/Data] [get_bd_addr_segs hier_periph/axi_timer_0/S_AXI/Reg]
assign_bd_address -offset 0x41E00000 -range 64K -target_address_space [get_bd_addr_spaces microblaze_0/Data] [get_bd_addr_segs hier_periph/axi_dma_0/S_AXI_LITE/Reg]
assign_bd_address -offset 0x44A00000 -range 64K -target_address_space [get_bd_addr_spaces microblaze_0/Data] [get_bd_addr_segs axi_quad_spi_flash/AXI_LITE/Reg]
assign_bd_address -offset 0x44A10000 -range 64K -target_address_space [get_bd_addr_spaces microblaze_0/Data] [get_bd_addr_segs hier_periph/axi_tft_0/S_AXI_MM/Reg]
assign_bd_address -offset 0x44A20000 -range 64K -target_address_space [get_bd_addr_spaces microblaze_0/Data] [get_bd_addr_segs hier_periph/AUDIO_0/S00_AXI/S00_AXI_reg]
assign_bd_address -offset 0x44A30000 -range 64K -target_address_space [get_bd_addr_spaces microblaze_0/Data] [get_bd_addr_segs hier_periph/KEYBOARD_0/S00_AXI/S00_AXI_reg]
assign_bd_address -offset 0x80000000 -range 128M -target_address_space [get_bd_addr_spaces microblaze_0/Data] [get_bd_addr_segs hier_mem/mig_7series_0/memmap/memaddr]
assign_bd_address -offset 0x00000000 -range 16K -target_address_space [get_bd_addr_spaces microblaze_0/Instruction] [get_bd_addr_segs hier_mem/microblaze_0_local_memory/ilmb_bram_if_cntlr/SLMB/Mem]
assign_bd_address -offset 0x80000000 -range 128M -target_address_space [get_bd_addr_spaces microblaze_0/Instruction] [get_bd_addr_segs hier_mem/mig_7series_0/memmap/memaddr]

validate_bd_design
save_bd_design
